# EasyEDA Pro project Type_C硬盘盒_2025-09-27_14-32-02.eprj, board PCB_第一版
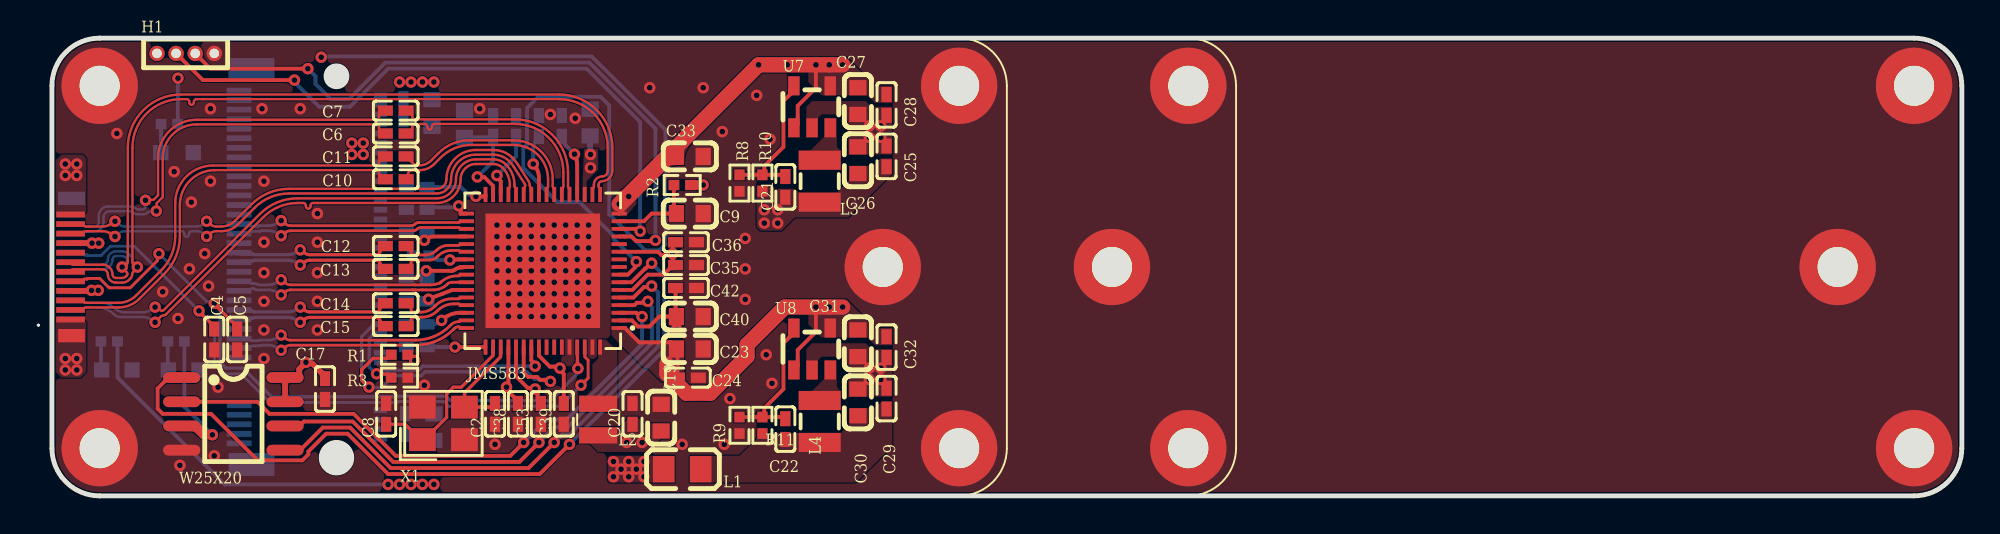
[diagram p3: board, top side]
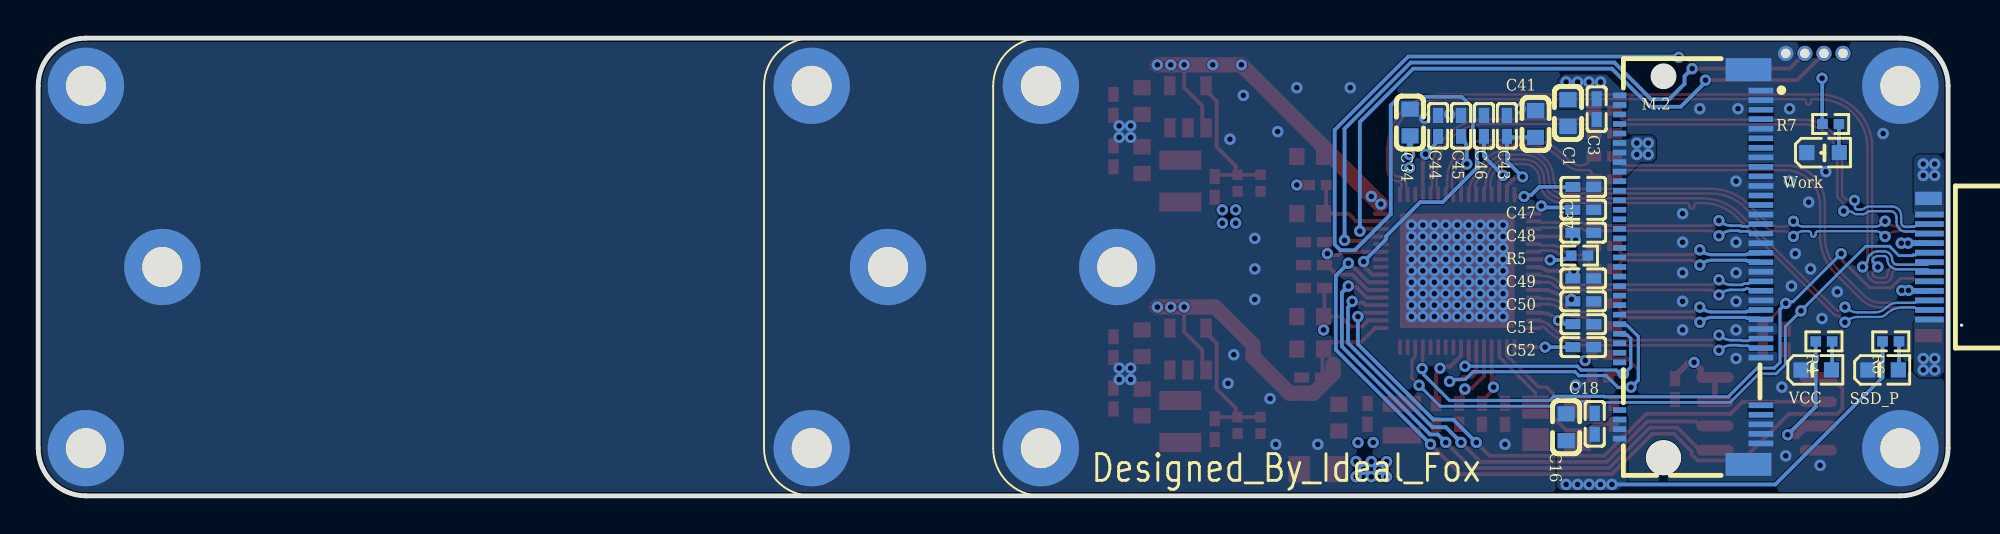
[diagram p4: board, bottom side, seen from below]

Outline 100.72 x 24 mm; copper layers: Top Layer, GND, VCC, Bottom Layer. Coordinates in mm from the lower left corner of the outline.
Outline path: 0.72,21.5 arc(1.45,23.27) 3.22,24 98.22,24 arc(99.99,23.27) 100.72,21.5 100.72,2.5 arc(99.99,0.73) 98.22,0 3.22,0 arc(1.45,0.73) 0.72,2.5 0.72,21.5
Stack: Top Layer 0.035mm / Dielectric 1 0.0711mm PP-006 er 4.1 / GND 0.0175mm / Dielectric1 0.32mm FR-4 er 4.8 / VCC 0.0175mm / Dielectric 2 0.0711mm PP-006 er 4.1 / Bottom Layer 0.035mm

## Design rules (mm)
net N_P1_TX: 85oum
net N_P0_TX: 85oum
net P1_TX: 85oum
net P1_RX: 85oum
net P0_TX: 85oum
net P0_RX: 85oum
net CLK: 85oum
net U_TX2: 90oum
net U_TX1: 90oum
net TX2: 90oum
net TX1: 90oum
net RX2: 90oum
net RX1: 90oum
net D: 90oum
net C1: 1_P1
net C2: 1_P1
net C3: 1_P1
net C4: 1_P1
net C5: 1_P1
net C6: 1_P1
net C7: 1_P1
net C8: 1_P1
net C9: 1_P1
net C10: 1_P1
net C11: 1_P1
net C12: 1_P1
net C13: 1_P1
net C14: 1_P1
net C15: 1_P1
net C16: 1_P1
net C17: 1_P1
net C18: 1_P1
net C19: 1_P1
net C20: 1_P1
net C21: 1_P1
net C22: 1_P1
net C23: 1_P1
net C24: 1_P1
net C25: 1_P1
net C26: 1_P1
net C27: 1_P1
net C28: 1_P1
net C29: 1_P1
net C30: 1_P1
net C31: 1_P1
net C32: 1_P1
net C33: 1_P1
net C34: 1_P1
net C35: 1_P1
net C36: 1_P1
net C37: 1_P1
net C38: 1_P1
net C39: 1_P1
net C40: 1_P1
net C41: 1_P1
net C42: 1_P1
net C43: 1_P1
net C44: 1_P1
net C45: 1_P1
net C46: 1_P1
net C47: 1_P1
net C48: 1_P1
net C49: 1_P1
net C50: 1_P1
net C51: 1_P1
net C52: 1_P1
net C53: 1_P1
net H1: 1_P1
net L1: 1_P1
net L2: 1_P1
net L3: 1_P1
net L4: 1_P1
net R1: 1_P1
net R2: 1_P1
net R3: 1_P1
net R4: 1_P1
net R5: 1_P1
net R6: 1_P1
net R7: 1_P1
net R8: 1_P1
net R9: 1_P1
net R10: 1_P1
net R11: 1_P1
net U7: 1_P1
net U8: 1_P1
net USB1: 1_P1
net X1: 1_P1
net JMS583: 1_P1
net W25X20: 1_P1
net M.2: 1_P1
net Work: 1_P1
net SSD_P: 1_P1
net VCC: 1_P1
net Designator15: Inside Board Components
net Designator12: Inside Board Components
net Designator14: Inside Board Components
net Designator13: Inside Board Components
net Designator11: Inside Board Components
net Designator10: Inside Board Components
net Designator9: Inside Board Components
net Designator8: Inside Board Components
net Designator7: Inside Board Components
net Designator4: Inside Board Components
net Designator6: Inside Board Components
net U_TX2_P: U_TX2
net U_TX2_N: U_TX2
net N_P1_TX_P: N_P1_TX
net N_P1_TX_N: N_P1_TX
net N_P0_TX_N: N_P0_TX
net N_P0_TX_P: N_P0_TX
net U_TX1_P: U_TX1
net U_TX1_N: U_TX1
net P1_TX_P: P1_TX
net P1_TX_N: P1_TX
net P1_RX_P: P1_RX
net P1_RX_N: P1_RX
net P0_TX_P: P0_TX
net P0_TX_N: P0_TX
net P0_RX_P: P0_RX
net P0_RX_N: P0_RX
net CLK_P: CLK
net CLK_N: CLK
net TX2_P: TX2
net TX2_N: TX2
net TX1_P: TX1
net TX1_N: TX1
net RX2_P: RX2
net RX2_N: RX2
net RX1_P: RX1
net RX1_N: RX1
net D_P: D
net D_N: D
template: 用户自定义配置
spacing safeClearance (default): track to track 0.119, other pairs 0 to 0.201
track width copperThickness1oz_2 (default): min 0.127, default 0.254, max 2.54
differential pair DiffPairsRouting_90oum (default): width min 0.099, default 0.124, max 0.381; gap min 0.099, default 0.119
differential pair DiffPairsRouting_85oum: width min 0.099, default 0.145, max 0.381; gap min 0.099, default 0.119
via viaSize (default): diameter min 0.5, default 0.61, max 10; hole min 0.3, default 0.305, max 6.299

## Placement (name value [footprint] x y rotation side)
C1  -  [C0603]  20.62 20.07 270 bottom
C2  -  [C0402]  23.92 4.3 90 top
C3  -  [C0402]  19.12 20.27 90 bottom
C4  -  [C0402]  9.22 8.2 270 top
C5  -  [C0402]  10.42 8.2 270 top
C6  -  [C0402]  18.72 19 0 top
C7  -  [C0402]  18.72 20.2 0 top
C8  -  [C0402]  18.22 4.3 270 top
C9  -  [C0603]  34.12 14.8 180 top
C10  -  [C0402]  18.72 16.6 0 top
C11  -  [C0402]  18.72 17.8 0 top
C12  -  [C0402]  18.72 13.1 180 top
C13  -  [C0402]  18.72 11.9 180 top
C14  -  [C0402]  18.72 10.1 180 top
C15  -  [C0402]  18.72 8.9 180 top
C16  -  [C0603]  20.72 3.6 90 bottom
C17  -  [C0402]  15.02 5.6 90 top
C18  -  [C0402]  19.22 3.77 270 bottom
C19  -  [C0603]  32.62 4.1 270 top
C20  -  [C0402]  31.12 4.3 270 top
C21  -  [C0402]  39.12 16.2 90 top
C22  -  [C0402]  39.12 3.5 90 top
C23  -  [C0603]  34.12 7.7 180 top
C24  -  [C0402]  34.02 6.2 180 top
C25  -  [C0402]  44.42 17.8 270 top
C26  -  [C0603]  42.92 17.6 270 top
C27  -  [C0603]  42.92 20.7 90 top
C28  -  [C0402]  44.42 20.5 90 top
C29  -  [C0402]  44.42 5.1 270 top
C30  -  [C0603]  42.92 4.9 270 top
C31  -  [C0603]  42.92 8 90 top
C32  -  [C0402]  44.42 7.8 90 top
C33  -  [C0603]  34.12 17.8 180 top
C34  -  [C0603]  28.89 19.58 270 bottom
C35  -  [C0402]  33.92 12.1 180 top
C36  -  [C0402]  33.92 13.3 180 top
C37  -  [C0402]  19.82 16.2 0 bottom
C38  -  [C0402]  25.12 4.3 90 top
C39  -  [C0402]  27.52 4.3 90 top
C40  -  [C0603]  34.12 9.4 180 top
C41  -  [C0603]  22.32 19.5 270 bottom
C42  -  [C0402]  33.92 10.9 180 top
C43  -  [C0402]  23.82 19.4 270 bottom
C44  -  [C0402]  27.42 19.4 270 bottom
C45  -  [C0402]  26.22 19.4 270 bottom
C46  -  [C0402]  25.02 19.4 270 bottom
C47  -  [C0402]  19.82 15 0 bottom
C48  -  [C0402]  19.82 13.8 0 bottom
C49  -  [C0402]  19.82 11.4 0 bottom
C50  -  [C0402]  19.82 10.2 0 bottom
C51  -  [C0402]  19.82 9 0 bottom
C52  -  [C0402]  19.82 7.8 0 bottom
C53  -  [C0402]  26.32 4.3 90 top
Designator4  -  [M2_HOLE]  48.22 2.5 0 top
Designator6  -  [M2_HOLE]  44.22 12 0 top
Designator7  -  [M2_HOLE]  48.22 21.5 0 top
Designator8  -  [M2_HOLE]  60.22 21.5 0 top
Designator9  -  [M2_HOLE]  60.22 2.5 0 top
Designator10  -  [M2_HOLE]  98.22 21.5 0 top
Designator11  -  [M2_HOLE]  94.22 12 0 top
Designator12  -  [M2_HOLE]  56.22 12 0 top
Designator13  -  [M2_HOLE]  3.22 21.5 0 top
Designator14  -  [M2_HOLE]  3.22 2.5 0 top
Designator15  -  [M2_HOLE]  98.22 2.5 0 top
H1  -  [HDR-TH_ZX-PZ1.0-1-4PZZ]  7.72 23.2 0 top
JMS583  -  [QFN-64_L8.0-W8.0-P0.40-TL-EP6.0]  26.42 11.8 180 top
L1  -  [L0805]  33.72 1.4 180 top
L2  -  [IND-SMD_L2.5-W2.0-VLS252012CX-150M]  29.32 4 90 top
L3  -  [IND-SMD_L2.5-W2.0_MHCHL2520]  40.92 16.5 90 top
L4  -  [IND-SMD_L2.5-W2.0_MHCHL2520]  40.92 3.9 90 top
M.2  -  [CONN-SMD_91302-225-067RCM]  14.22 12 270 bottom
R1  -  [R0402]  18.92 7.4 0 top
R2  -  [R0402]  33.72 16.3 180 top
R3  -  [R0402]  18.92 6.2 0 top
R4  -  [R0402]  7.22 8.1 180 bottom
R5  -  [R0402]  20.02 12.6 180 bottom
R6  -  [R0402]  3.72 8.1 180 bottom
R7  -  [R0402]  6.87 19.5 180 bottom
R8  -  [R0402]  36.72 16.4 90 top
R9  -  [R0402]  36.72 3.7 90 top
R10  -  [R0402]  37.92 16.4 270 top
R11  -  [R0402]  37.92 3.7 270 top
SSD_P  -  [LED0603-RD_GREEN]  4.12 6.6 180 bottom
U7  -  [SOT-23-5_L2.9-W1.6-P0.95-LS2.8-BL]  40.52 20.4 0 top
U8  -  [SOT-23-5_L2.9-W1.6-P0.95-LS2.8-BL]  40.52 7.7 0 top
USB1  -  [USB-TYPE-C-SMD_U261-241N-4BS60]  1.72 12 90 bottom
VCC  -  [LED0603-RD_GREEN]  7.62 6.6 180 bottom
W25X20  -  [SOIC-8_L5.0-W4.0-P1.27-LS6.0-BL]  10.22 4.3 270 top
Work  -  [LED0603-R-RD]  7.27 18 180 bottom
X1  -  [CRYSTAL-SMD_4P-L3.2-W2.5-BL]  21.22 3.8 0 top

## Footprints (pads in the part's own frame, mm; a bottom-side part is the same pattern mirrored in y, then rotated)
C0402
  rect 0.79x0.54 smd: 1(-0.545,0) 2(0.545,0)
C0603
  rect 0.8x0.9 smd: 1(-0.7,0) 2(0.7,0)
CONN-SMD_91302-225-067RCM
  rect 0.3x1.3 smd: 1(-9.25,3.7) 3(-8.75,3.7) 5(-8.25,3.7) 7(-7.75,3.7) 9(-7.25,3.7) 11(-6.75,3.7) 13(-6.25,3.7) 15(-5.75,3.7) 17(-5.25,3.7) 19(-4.75,3.7) 21(-4.25,3.7) 23(-3.75,3.7) 25(-3.25,3.7) 27(-2.75,3.7) 29(-2.25,3.7) 31(-1.75,3.7) 33(-1.25,3.7) 35(-0.75,3.7) 37(-0.25,3.7) 39(0.25,3.7) 41(0.75,3.7) 43(1.25,3.7) 45(1.75,3.7) 47(2.25,3.7) 49(2.75,3.7) 51(3.25,3.7) 53(3.75,3.7) 55(4.25,3.7) 57(4.75,3.7) 67(7.25,3.7) 69(7.75,3.7) 71(8.25,3.7) 73(8.75,3.7) 75(9.25,3.7)
  rect 0.3x0.7 smd: 2(-9,-3.7) 4(-8.5,-3.7) 6(-8,-3.7) 8(-7.5,-3.7) 10(-7,-3.7) 12(-6.5,-3.7) 14(-6,-3.7) 16(-5.5,-3.7) 18(-5,-3.7) 20(-4.5,-3.7) 22(-4,-3.7) 24(-3.5,-3.7) 26(-3,-3.7) 28(-2.5,-3.7) 30(-2,-3.7) 32(-1.5,-3.7) 34(-1,-3.7) 36(-0.5,-3.7) 38(0,-3.7) 40(0.5,-3.7) 42(1,-3.7) 44(1.5,-3.7) 46(2,-3.7) 48(2.5,-3.7) 50(3,-3.7) 52(3.5,-3.7) 54(4,-3.7) 56(4.5,-3.7) 58(5,-3.7) 68(7.5,-3.7) 70(8,-3.7) 72(8.5,-3.7) 74(9,-3.7)
  rect 1.2x2.4 smd: 76(-10.35,3.05) 77(10.35,3.05)
CRYSTAL-SMD_4P-L3.2-W2.5-BL
  rect 1.4x1.2 smd: 1(-1.1,-0.85) 2(1.1,-0.85) 3(1.1,0.85) 4(-1.1,0.85)
HDR-TH_ZX-PZ1.0-1-4PZZ
  round 0.8 hole 0.5: 1(-1.5,0) 2(-0.5,0) 3(0.5,0) 4(1.5,0)
IND-SMD_L2.5-W2.0-VLS252012CX-150M
  rect 0.85x2 smd: 1(-0.83,0) 2(0.83,0)
IND-SMD_L2.5-W2.0_MHCHL2520
  rect 1x2.2 smd: 1(-1.1,0) 2(1.1,0)
L0805
  rect 1.133x1.377 smd: 1(-0.966,0) 2(0.966,0)
LED0603-R-RD
  rect 0.8x0.8 smd: 1(0.851,0) 2(-0.851,0)
LED0603-RD_GREEN
  rect 0.8x0.8 smd: 1(-0.799,-0.004) 2(0.799,0.004)
M2_HOLE
  round 4 hole 2.1: 16(0,0)
QFN-64_L8.0-W8.0-P0.40-TL-EP6.0
  rect 0.8x0.2 smd: 1(-4,3) 2(-4,2.6) 3(-4,2.2) 4(-4,1.8) 5(-4,1.4) 6(-4,1) 7(-4,0.6) 8(-4,0.2) 9(-4,-0.2) 10(-4,-0.6) 11(-4,-1) 12(-4,-1.4) 13(-4,-1.8) 14(-4,-2.2) 15(-4,-2.6) 16(-4,-3) 33(4,-3) 34(4,-2.6) 35(4,-2.2) 36(4,-1.8) 37(4,-1.4) 38(4,-1) 39(4,-0.6) 40(4,-0.2) 41(4,0.2) 42(4,0.6) 43(4,1) 44(4,1.4) 45(4,1.8) 46(4,2.2) 47(4,2.6) 48(4,3)
  rect 0.2x0.8 smd: 17(-3,-4) 18(-2.6,-4) 19(-2.2,-4) 20(-1.8,-4) 21(-1.4,-4) 22(-1,-4) 23(-0.6,-4) 24(-0.2,-4) 25(0.2,-4) 26(0.6,-4) 27(1,-4) 28(1.4,-4) 29(1.8,-4) 30(2.2,-4) 31(2.6,-4) 32(3,-4) 49(3,4) 50(2.6,4) 51(2.2,4) 52(1.8,4) 53(1.4,4) 54(1,4) 55(0.6,4) 56(0.2,4) 57(-0.2,4) 58(-0.6,4) 59(-1,4) 60(-1.4,4) 61(-1.8,4) 62(-2.2,4) 63(-2.6,4) 64(-3,4)
  rect 6x6 smd: 65(0,0)
R0402
  rect 0.566x0.54 smd: 1(-0.433,0) 2(0.433,0)
SOIC-8_L5.0-W4.0-P1.27-LS6.0-BL
  oval 0.569x1.95 smd: 1(-1.905,-2.705) 2(-0.635,-2.705) 3(0.635,-2.705) 4(1.905,-2.705) 5(1.905,2.705) 6(0.635,2.705) 7(-0.635,2.705) 8(-1.905,2.705)
SOT-23-5_L2.9-W1.6-P0.95-LS2.8-BL
  rect 0.6x1 smd: 1(-0.95,-1.1) 2(0,-1.1) 3(0.95,-1.1) 4(0.95,1.1) 5(-0.95,1.1)
USB-TYPE-C-SMD_U261-241N-4BS60
  rect 0.7x1.4 smd far side: 1(-3.6,0.025)
  rect 0.7x1.4 smd: 2(3.6,0.025)
  rect 0.3x1.5 smd: A1(2.75,-0.025) A2(2.25,-0.025) A3(1.75,-0.025) A4(1.25,-0.025) A5(0.75,-0.025) A6(0.25,-0.025) A7(-0.25,-0.025) A8(-0.75,-0.025) A9(-1.25,-0.025) A10(-1.75,-0.025) A11(-2.25,-0.025) A12(-2.75,-0.025)
  rect 0.3x1.5 smd far side: B1(-2.75,-0.025) B2(-2.25,-0.025) B3(-1.75,-0.025) B4(-1.25,-0.025) B5(-0.75,-0.025) B6(-0.25,-0.025) B7(0.25,-0.025) B8(0.75,-0.025) B9(1.25,-0.025) B10(1.75,-0.025) B11(2.25,-0.025) B12(2.75,-0.025)

## Nets
3V3: C22.1 C29.2 C30.2 L1.1 L4.1 R11.2
AVDDL: C19.2 C20.2 C21.1 C25.2 C26.2 C40.2 C41.2 C42.2 C43.2 C44.2 C45.2 C46.2 C47.2 C48.2 C49.2 C50.2 C51.2 C52.2 C53.2 JMS583.2 JMS583.20 JMS583.25 JMS583.30 JMS583.31 JMS583.33 JMS583.36 JMS583.40 JMS583.43 JMS583.46 JMS583.49 JMS583.53 L2.1 L3.1 R10.2
GND: C1.2 C2.1 C3.1 C4.2 C5.2 C8.1 C9.1 C16.2 C17.1 C18.1 C19.1 C20.1 C23.1 C24.1 C25.1 C26.1 C27.1 C28.1 C29.1 C30.1 C31.1 C32.1 C33.1 C34.1 C35.1 C36.1 C37.1 C38.1 C39.1 C40.1 C41.1 C42.1 C43.1 C44.1 C45.1 C46.1 C47.1 C48.1 C49.1 C50.1 C51.1 C52.1 C53.1 Designator4.16 Designator6.16 Designator7.16 Designator8.16 Designator9.16 Designator10.16 Designator11.16 Designator12.16 Designator13.16 Designator14.16 Designator15.16 H1.4 JMS583.60 JMS583.63 JMS583.65 M.2.1 M.2.3 M.2.9 M.2.15 M.2.21 M.2.27 M.2.33 M.2.39 M.2.45 M.2.51 M.2.57 M.2.71 M.2.73 M.2.75 M.2.76 M.2.77 R3.2 R5.2 R8.1 R9.1 SSD_P.1 U7.2 U8.2 USB1.1 USB1.2 USB1.A1 USB1.A12 USB1.B1 USB1.B12 VCC.1 W25X20.4 Work.2 X1.2 X1.4
VCC: C17.2 C34.2 C35.2 C36.2 C37.2 C38.2 C39.2 H1.1 JMS583.6 JMS583.11 JMS583.19 JMS583.32 JMS583.52 JMS583.56 R1.2 R2.1 R4.1 W25X20.3 W25X20.7 W25X20.8
VDDREG: C23.2 C24.2 C27.2 C28.2 C31.2 C32.2 C33.2 JMS583.1 JMS583.16 U7.1 U7.4 U8.1 U8.4 USB1.A4 USB1.A9 USB1.B4 USB1.B9
CC1: C4.1 JMS583.62 USB1.A5
CC2: C5.1 JMS583.61 USB1.B5
CLK_N: JMS583.47 M.2.53
CLK_P: JMS583.48 M.2.55
D_N: JMS583.17 USB1.A7 USB1.B7
D_P: JMS583.18 USB1.A6 USB1.B6
GPIO0: JMS583.3 W25X20.2
GPIO1: JMS583.4 W25X20.6
GPIO2: JMS583.5 W25X20.5
GPIO3: JMS583.7 W25X20.1
GPIO4: JMS583.8 R7.1
GPIO8: H1.3 JMS583.13
GPIO9: H1.2 JMS583.14
LXO: JMS583.64 L2.2
M.2_3V3: C1.1 C3.2 C16.1 C18.2 L1.2 M.2.2 M.2.4 M.2.12 M.2.14 M.2.16 M.2.18 M.2.70 M.2.72 M.2.74 R6.1
N_P0_TX_N: C14.2 M.2.47
N_P0_TX_P: C15.2 M.2.49
N_P1_TX_N: C12.2 M.2.35
N_P1_TX_P: C13.2 M.2.37
NETC21_2: C21.2 R8.2 R10.1 U7.5
NETC22_2: C22.2 R9.2 R11.1 U8.5
NETL3_2: L3.2 U7.3
NETL4_2: L4.2 U8.3
NETR4_2: R4.2 VCC.2
NETR5_1: JMS583.39 R5.1
NETR6_2: R6.2 SSD_P.2
NETR7_2: R7.2 Work.1
P0_RX_N: JMS583.41 M.2.41
P0_RX_P: JMS583.42 M.2.43
P0_TX_N: C14.1 JMS583.44
P0_TX_P: C15.1 JMS583.45
P1_RX_N: JMS583.34 M.2.29
P1_RX_P: JMS583.35 M.2.31
P1_TX_N: C12.1 JMS583.37
P1_TX_P: C13.1 JMS583.38
PCIE_CLK: JMS583.55 M.2.52 R3.1
PCIE_RST: JMS583.54 M.2.50 R1.1
RST: C9.2 JMS583.15 R2.2
RX1_N: JMS583.27 USB1.B10
RX1_P: JMS583.26 USB1.B11
RX2_N: JMS583.28 USB1.A10
RX2_P: JMS583.29 USB1.A11
SBU1: USB1.A8
SBU2: USB1.B8
TX1_N: C6.2 JMS583.22
TX1_P: C7.2 JMS583.21
TX2_N: C11.2 JMS583.23
TX2_P: C10.2 JMS583.24
U_TX1_N: C6.1 USB1.A3
U_TX1_P: C7.1 USB1.A2
U_TX2_N: C11.1 USB1.B3
U_TX2_P: C10.1 USB1.B2
XIN: C8.2 JMS583.50 X1.1
XOUT: C2.2 JMS583.51 X1.3

Pads without a net: JMS583 9 10 12 57 58 59; M.2 5 6 7 8 10 11 13 17 19 20 22 23 24 25 26 28 30 32 34 36 38 40 42 44 46 48 54 56 58 67 68 69

## Via types
v1: diameter 0.6, hole 0.3, Top Layer to Bottom Layer, 249 vias

## Routing (per net, layer and track width the routed paths; a pad name or vN(x,y) marks a point on that pad's centre or on a via; arc(x,y) is an arc through that point)
AVDDL: length 89.4
  Top Layer w0.2: JMS583.46 22.08,9.6 arc(21.56,9.5) v1(21.12,9.2) ; v1(20.32,11.8) 21.62,11.8 arc(21.64,11.8) 21.66,11.8 arc(21.69,11.81) 21.72,11.81 arc(21.78,11.83) 21.84,11.87 arc(21.91,11.92) 21.99,11.95 JMS583.40 ; JMS583.20 28.22,17.42 arc(28.21,17.54) 28.18,17.65 v1(28.08,17.92) ; v1(21.82,7.8) JMS583.49 ; v1(22.02,15.2) 22.02,15.09 22.12,14.99 22.12,14.8 JMS583.33 ; v1(33.42,8.7) C40.2 32.52,9.4 32,8.88 31.4,8.88 31.08,9.2 JMS583.2 ; JMS583.25 26.22,16.68 arc(26.14,17.07) v1(25.92,17.4) ; v1(23,16.72) 23.35,16.72 23.82,16.25 JMS583.31 ; JMS583.30 24.22,16.5 24.02,16.7 v1(24.02,16.8) ; C53.2 26.15,5.02 26.15,5.36 26.02,5.49 v1(26.02,5.6) 25.96,5.66 25.63,5.66 25.02,6.27 JMS583.53 ; v1(20.44,10.31) 20.64,10.4 arc(20.65,10.41) 20.66,10.41 21.15,10.59 arc(21.16,10.59) 21.18,10.6 21.65,10.79 arc(21.69,10.8) 21.73,10.8 JMS583.43 ; JMS583.36 20.7,13.6 arc(20.44,13.55) v1(20.22,13.4) ; 33.37,9.44 C42.2
  Top Layer w0.5: v1(33.42,8.7) C40.2 33.37,9.44
  VCC w0.5: v1(33.42,8.7) 35.42,6.7 ; 25.98,4.12 26.02,4.16 v1(26.02,5.6)
  VCC w0.6: v1(28.08,17.92) 27.36,17.2 27.22,17.2
  VCC w1.8: 38.38,14.66 38.38,9.66 32.02,3.3 29.09,3.3 28.27,4.12 23.7,4.12 21.42,6.4 21.42,8.1 19.92,9.6 19.92,13.6 21.52,15.2 21.52,15.5 21.6,15.58 21.6,16.25 22.55,17.2 27.22,17.2
  Bottom Layer w0.172: 20.43,13.61 20.43,13.73 C48.2 20.22,13.66 v1(20.22,13.4)
  Bottom Layer w0.2: v1(22.02,15.2) 21.94,15.12 20.49,15.12 C47.2 ; C41.2 23.76,18.8 C43.2 23.82,17.55 v1(23,16.72) ; C51.2 20.64,9 arc(20.9,9.05) v1(21.12,9.2) ; v1(24.02,16.8) 25.02,17.8 C46.2 ; v1(20.32,11.8) 20.32,11.51 arc(20.33,11.45) C49.2 ; v1(25.92,17.4) 25.92,18.13 arc(26,18.52) C45.2 ; v1(28.08,17.92) 27.61,18.39 arc(27.47,18.6) C44.2 ; C52.2 v1(21.82,7.8)
  vias: v1(30.82,2.8) v1(31.62,2.8) v1(38.02,15) v1(38.02,14.3) v1(38.72,15) v1(38.72,14.3)
GND:
  vias: v1(1.42,17.4) v1(1.42,16.8) v1(1.42,7.2) v1(1.42,6.6) v1(2.02,17.4) v1(2.02,16.8) v1(2.02,7.2) v1(2.02,6.6) v1(4.12,19) v1(6.52,10.7) v1(7.12,17) v1(7.32,9.3) v1(7.42,1.6) v1(7.92,11.9) v1(8.02,15.4) v1(8.72,12.7) v1(8.92,11) v1(9.02,20.3) v1(9.02,16.5) v1(9.22,2.1) v1(9.42,5.7) v1(11.72,20.3) v1(11.82,16.5) v1(11.82,13.3) v1(11.82,11.7) v1(11.82,10.2) v1(11.82,8.7) v1(11.82,7.2) v1(13.72,20.3) v1(14.62,14.8) v1(14.62,13.3) v1(14.62,11.7) v1(14.62,10.2) v1(14.62,8.7) v1(20.22,5.8) v1(23.12,20.3) v1(23.92,2.7) v1(24.02,14.2) v1(24.02,13.6) v1(24.02,13) v1(24.02,12.4) v1(24.02,11.8) v1(24.02,11.2) v1(24.02,10.6) v1(24.02,10) v1(24.02,9.4) v1(24.62,14.2) v1(24.62,13.6) v1(24.62,13) v1(24.62,12.4) v1(24.62,11.8) v1(24.62,11.2) v1(24.62,10.6) v1(24.62,10) v1(24.62,9.4) v1(25.22,14.2) v1(25.22,13.6) v1(25.22,13) v1(25.22,12.4) v1(25.22,11.8) v1(25.22,11.2) v1(25.22,10.6) v1(25.22,10) v1(25.22,9.4) v1(25.82,14.2) v1(25.82,13.6) v1(25.82,13) v1(25.82,12.4) v1(25.82,11.8) v1(25.82,11.2) v1(25.82,10.6) v1(25.82,10) v1(25.82,9.4) v1(26.42,14.2) v1(26.42,13.6) v1(26.42,13) v1(26.42,12.4) v1(26.42,11.8) v1(26.42,11.2) v1(26.42,10.6) v1(26.42,10) v1(26.42,9.4) v1(26.82,20) v1(27.02,14.2) v1(27.02,13.6) v1(27.02,13) v1(27.02,12.4) v1(27.02,11.8) v1(27.02,11.2) v1(27.02,10.6) v1(27.02,10) v1(27.02,9.4) v1(27.62,14.2) v1(27.62,13.6) v1(27.62,13) v1(27.62,12.4) v1(27.62,11.8) v1(27.62,11.2) v1(27.62,10.6) v1(27.62,10) v1(27.62,9.4) v1(28.12,19.8) v1(28.22,14.2) v1(28.22,13.6) v1(28.22,13) v1(28.22,12.4) v1(28.22,11.8) v1(28.22,11.2) v1(28.22,10.6) v1(28.22,10) v1(28.22,9.4) v1(28.82,14.2) v1(28.82,13.6) v1(28.82,13) v1(28.82,12.4) v1(28.82,11.8) v1(28.82,11.2) v1(28.82,10.6) v1(28.82,10) v1(28.82,9.4) v1(32.02,21.4) v1(33.72,2.7) v1(34.82,21.4) v1(35.82,19.1) v1(35.92,2.7) v1(36.22,5.1) v1(37.02,13.5) v1(37.02,11.9) v1(37.02,10.3) v1(37.62,21) v1(38.12,7.4) v1(38.32,18.7) v1(38.42,5.9) v1(43.52,19.4) v1(43.52,18.8) v1(43.52,6.7) v1(43.52,6.1) v1(44.12,19.4) v1(44.12,18.8) v1(44.12,6.7) v1(44.12,6.1)
VCC: length 128.4
  Top Layer w0.2: C36.2 33.22,13.14 v1(33.22,12.7) ; v1(33.22,12.7) 33.22,12.13 33.25,12.1 32.75,11.6 31.91,11.6 31.11,10.8 JMS583.6 ; v1(33.22,12.7) 33.14,12.62 32.63,12.62 32.46,12.8 JMS583.11 ; JMS583.52 24.62,5.91 24.52,5.81 v1(24.52,5.7) 24.6,5.62 24.6,5.49 25.12,4.97 C38.2 ; JMS583.32 23.42,15.7 v1(22.92,15.7) ; C39.2 27.52,6.39 27.32,6.59 v1(27.32,6.7) 27.24,6.78 26.79,6.78 26.22,7.35 JMS583.56
  Top Layer w0.3: C17.2 15.02,6.27 14.35,6.94 14.08,6.94 v1(14.02,7) 13.67,6.65 13.67,6.33 13.54,6.2 W25X20.8 W25X20.7
  Top Layer w0.5: v1(9.12,3.2) 9.1,3.22 8.67,3.22 8.22,3.67 W25X20.3 ; R2.1 v1(34.82,16.3)
  GND w1: v1(14.02,7) 16.24,4.78 17.7,4.78 19.72,6.8 v1(19.72,7.1)
  VCC w0.6: 28.94,17.55 28.94,17.22 v1(28.92,17.2) ; v1(24.52,5.7) 24.52,6.32 26.2,8 27.32,8 ; 27.32,8 27.42,8.1 ; 27.32,8 v1(27.32,6.7) ; v1(22.92,15.7) 29.52,15.7 29.52,17.3 v1(28.92,17.9)
  VCC w0.8: H1.1 6.22,19.77 1.62,15.17 1.62,10.29 8.71,3.2 v1(9.12,3.2) ; v1(34.82,16.3) 34.82,14.3 v1(33.22,12.7)
  VCC w1: 29.5,17.32 29.5,14.82 29.74,14.58 29.74,9.02 28.82,8.1 27.42,8.1 ; v1(9.12,3.2) 10.22,3.2 v1(14.02,7) ; 29.27,17.55 33.57,17.55 v1(34.82,16.3) ; v1(19.72,7.1) 18.4,8.42 18.4,15.2 22.04,18.84 28.46,18.84 29,18.3 29,17.9
  Bottom Layer w0.2: v1(22.92,15.7) 22.84,15.77 22.54,15.77 22.12,16.2 C37.2 ; v1(9.12,3.2) 7.65,4.67 R4.1
  Bottom Layer w0.3: C34.2 28.89,17.92 arc(28.9,17.91) v1(28.92,17.9)
VDDREG: length 109.8
  Top Layer w0.2: U7.1 39.77,19.5 39.77,20.45 40.72,21.4 v1(40.72,22.6) ; C33.2 33.42,17.75 33.12,17.45 33.07,17.45 JMS583.16 ; C24.2 33.47,7.64 C23.2 33.42,7.75 33.12,8.05 31.47,8.05 30.72,8.8 JMS583.1 ; U8.1 39.77,6.8 39.77,7.65 40.72,8.6 v1(40.72,9.9)
  Top Layer w0.3: v1(3.17,13.25) v1(2.82,13.25) USB1.A4 ; v1(3.14,10.78) 3.12,10.75 USB1.A9
  Top Layer w0.8: v1(30.42,15.3) v1(37.72,22.6) v1(40.72,22.6) v1(41.42,22.6) v1(42.12,22.6) ; 32.92,6.9 32.92,6.4 33.94,5.38 35.19,5.38 37.11,7.31 37.11,7.92 39.09,9.9 v1(40.72,9.9) v1(41.42,9.9) v1(42.12,9.9)
  VCC w1.3: 2.79,13.25 2.79,14.69 6.64,18.54 14.13,18.54 18.49,22.9 30.15,22.9 30.45,22.6 v1(40.72,22.6) v1(41.42,22.6) v1(42.12,22.6) ; v1(2.82,13.25) 3.07,13 3.07,11.05 v1(2.79,10.78)
  VCC w2: v1(41.42,9.9) 41.07,10.25 41.07,13.7 41.42,14.05 v1(41.42,22.6)
  Bottom Layer w0.3: v1(3.14,10.78) 3.12,10.75 USB1.A9 ; v1(3.17,13.25) v1(2.82,13.25) USB1.A4
  vias: v1(30.92,15.7) v1(39.22,22.6)
CC1: length 35.6
  Top Layer w0.15: v1(28.42,5.8) 28.79,6.17 28.79,7.12 28.62,7.29 28.62,7.79 JMS583.62
  Top Layer w0.17: v1(8.42,9.7) 8.42,9.67 9.22,8.87 C4.1
  Bottom Layer w0.15: v1(28.42,5.8) 27.32,4.7 21.49,4.7 21.25,4.94 18.86,4.94 18.82,4.9 12.12,4.9 10.62,6.4 9.72,6.4 9.24,6.88 9.24,8.88 v1(8.42,9.7) 5.03,13.09 3.78,13.09 3.3,12.6 2.58,12.6 2.54,12.64 2.41,12.64 2.29,12.75 USB1.A5
CC2: length 36.4
  Top Layer w0.15: USB1.B5 2.29,11.25 2.41,11.36 2.54,11.36 2.58,11.4 3.22,11.4 3.71,10.91 4.82,10.91 6.24,12.33 6.24,12.62 v1(6.32,12.7)
  Top Layer w0.17: v1(28.26,6.68) 28.23,6.7 28.23,7.78 JMS583.61 ; C5.1 10.42,8.87 9.22,10.07 v1(9.22,10.1)
  Bottom Layer w0.15: v1(6.32,12.7) 8.84,10.18
  Bottom Layer w0.17: v1(28.26,6.68) 28.18,6.59 28.18,6.36 26.82,5 21.58,5 21.36,5.22 18.74,5.22 18.71,5.19 12.22,5.19 10.72,6.7 9.82,6.7 9.52,7 9.52,9.79 9.22,10.09 v1(9.22,10.1) 9.14,10.18 8.84,10.18
CLK_N: length 12.4
  Top Layer w0.145: JMS583.47 22.17,9.2 arc(22.12,9.19) 22.08,9.17 arc(22.05,9.14) 22,9.13 arc(21.79,9.09) 21.62,8.97 21.55,8.91 arc(20.73,8.36) 19.76,8.17 13.22,8.17 arc(13.05,8.2) 12.9,8.3 12.8,8.4 arc(12.76,8.42) v1(12.72,8.43)
  Bottom Layer w0.145: M.2.53 10.94,8.25 arc(11.01,8.23) 11.08,8.19 arc(11.14,8.15) 11.22,8.13 11.49,8.13 arc(11.51,8.14) 11.53,8.15 arc(11.55,8.16) 11.57,8.17 12.07,8.17 arc(12.38,8.23) 12.64,8.4 arc(12.68,8.42) v1(12.72,8.43)
CLK_P: length 12.4
  Top Layer w0.145: JMS583.48 22.17,8.8 arc(22.12,8.81) 22.08,8.83 arc(22.05,8.86) 22,8.87 arc(21.9,8.85) 21.8,8.78 21.74,8.72 arc(20.83,8.11) 19.76,7.9 13.22,7.9 arc(13.05,7.87) 12.9,7.77 12.8,7.66 arc(12.76,7.64) v1(12.72,7.63)
  Bottom Layer w0.145: M.2.55 10.94,7.75 arc(11.01,7.77) 11.08,7.81 arc(11.14,7.85) 11.22,7.87 11.6,7.87 arc(11.62,7.87) 11.64,7.88 arc(11.66,7.9) 11.68,7.9 12.07,7.9 arc(12.38,7.84) 12.64,7.66 arc(12.68,7.64) v1(12.72,7.63)
D_N: length 46
  Top Layer w0.125: JMS583.17 29.42,16.05 arc(29.41,16.1) 29.38,16.14 arc(29.35,16.18) 29.34,16.23 29.34,16.32 arc(29.39,16.45) 29.52,16.5 arc(29.9,16.66) 30.06,17.05 30.06,18.26 arc(29.25,20.23) 27.28,21.05 7.47,21.05 arc(5.51,20.23) 4.69,18.26 4.69,12.3 arc(4.6,12.09) v1(4.39,12) ; v1(4.39,12) arc(4.4,12.03) 4.42,12.05 ; v1(4.39,12) arc(4.4,11.97) 4.42,11.95 4.63,11.73 arc(4.66,11.69) 4.67,11.64 arc(4.66,11.59) 4.63,11.55 4.59,11.51 arc(4.5,11.45) 4.39,11.42 4.07,11.42 arc(3.95,11.48) 3.89,11.6 arc(3.74,11.97) 3.37,12.12 1.82,12.12 arc(1.73,12.16) USB1.B7
  Bottom Layer w0.125: USB1.A7 arc(1.73,11.84) 1.82,11.88 3.37,11.88 arc(3.74,12.03) 3.89,12.4 arc(3.95,12.52) 4.07,12.58 4.39,12.58 arc(4.5,12.55) 4.59,12.49 4.63,12.45 arc(4.66,12.41) 4.67,12.36 arc(4.66,12.31) 4.63,12.27 4.42,12.05 arc(4.4,12.03) v1(4.39,12)
D_P: length 46.3
  Top Layer w0.125: JMS583.18 29.02,16.05 arc(29.03,16.1) 29.06,16.14 arc(29.09,16.18) 29.1,16.23 29.1,16.32 arc(29.22,16.62) 29.52,16.75 arc(29.73,16.83) 29.82,17.05 29.82,18.26 arc(29.08,20.06) 27.28,20.8 8.28,20.8 arc(8.19,20.76) 8.15,20.67 8.15,20.62 arc(8.12,20.54) 8.03,20.5 arc(7.94,20.54) 7.91,20.62 7.91,20.67 arc(7.87,20.76) 7.78,20.8 7.48,20.8 arc(5.68,20.06) 4.94,18.26 4.94,12.26 arc(5.01,12.08) v1(5.19,12) ; v1(5.19,12) arc(5.19,11.97) 5.17,11.95 4.99,11.76 arc(4.94,11.68) 4.92,11.59 arc(4.9,11.49) 4.84,11.41 4.76,11.33 arc(4.59,11.22) 4.39,11.18 4.07,11.18 arc(3.77,11.3) 3.65,11.6 arc(3.57,11.8) 3.37,11.88 1.82,11.88 arc(1.73,11.84) USB1.B6 ; v1(5.19,12) arc(5.19,12.03) 5.17,12.05
  Bottom Layer w0.125: v1(5.19,12) arc(5.19,12.03) 5.17,12.05 4.99,12.24 arc(4.94,12.32) 4.92,12.41 arc(4.9,12.51) 4.84,12.59 4.76,12.67 arc(4.59,12.78) 4.39,12.82 4.07,12.82 arc(3.77,12.7) 3.65,12.4 arc(3.57,12.2) 3.37,12.12 1.82,12.12 arc(1.73,12.16) USB1.A6
GPIO0: length 30.4
  Top Layer w0.2: JMS583.3 31.31,9.6 31.51,9.4 v1(31.62,9.4) ; W25X20.2 11.48,4.94 12.11,4.3 16.52,4.3 18.72,2.1 24.72,2.1 v1(25.42,2.8)
  Bottom Layer w0.2: v1(25.42,2.8) 26.62,4 27.67,4 31.62,7.95 v1(31.62,9.4)
GPIO1: length 26.6
  Top Layer w0.2: W25X20.6 13.68,3.67 13.92,3.9 16.47,3.9 18.59,1.78 25.2,1.78 v1(26.22,2.8) ; v1(31.92,10.2) 31.84,10.12 31.34,10.12 31.22,10 JMS583.4
  Bottom Layer w0.2: v1(26.22,2.8) 27.02,3.6 27.72,3.6 32.14,8.02 32.14,9.88 31.92,10.1 v1(31.92,10.2)
GPIO2: length 28.8
  Top Layer w0.2: W25X20.5 13.71,2.39 14.9,3.58 16.33,3.58 18.45,1.46 25.68,1.46 v1(27.02,2.8) ; JMS583.5 31.17,10.4 31.72,10.95 32.07,10.95 v1(32.12,11)
  Bottom Layer w0.2: v1(27.02,2.8) 27.44,3.22 27.84,3.22 32.46,7.84 32.46,10.66 v1(32.12,11)
GPIO3: length 41.4
  Top Layer w0.2: W25X20.1 6.82,6.2 6.25,5.63 6.25,4.57 6.52,4.3 9.05,4.3 11.49,1.86 13.84,1.86 14.15,2.17 14.15,2.33 15.08,3.26 16.2,3.26 18.32,1.14 26.26,1.14 v1(27.82,2.7) ; JMS583.7 31.06,11.2 31.78,11.92 31.8,11.92 32.08,12.2 v1(32.12,12.2)
  Bottom Layer w0.2: v1(27.82,2.7) 32.78,7.66 32.78,11.54 v1(32.12,12.2)
GPIO4: length 62.9
  Top Layer w0.2: JMS583.8 30.87,11.6 31.24,11.97 31.24,12.2 v1(31.32,12.28)
  VCC w0.2: v1(7.32,21.9) 10.52,21.9 11.62,23 v1(14.82,23)
  Bottom Layer w0.2: v1(14.82,23) 14.86,23.04 28.98,23.04 32.84,19.19 32.84,13.18 32.53,12.88 31.78,12.88 29.9,14.76 29.9,20.47 29.45,20.92 26.18,20.92 25.6,20.34 25.6,18.42 25.4,18.22 25.4,17.18 27.18,15.4 28.35,15.4 30.14,13.62 30.14,13.46 v1(31.32,12.28) ; v1(7.32,21.9) 7.31,21.89 7.31,19.5 R7.1
GPIO8: length 35.4
  Top Layer w0.2: v1(14.12,22.4) 9.02,22.4 H1.3 ; v1(32.32,13.4) 32.28,13.36 31.3,13.36 31.06,13.6 JMS583.13
  Bottom Layer w0.2: v1(32.32,13.4) 32.32,19.25 28.85,22.72 18.19,22.72 16.27,20.8 15.32,20.8 14.52,21.6 14.52,22 v1(14.12,22.4)
GPIO9: length 34.4
  Top Layer w0.2: v1(31.52,13.88) 31.41,13.88 31.29,14 JMS583.14 ; v1(13.42,21.8) 8.62,21.8 H1.2
  Bottom Layer w0.2: v1(13.42,21.8) 13.42,21.69 14.71,20.4 16.32,20.4 18.32,22.4 28.72,22.4 31.52,19.6 v1(31.52,13.88)
M.2_3V3: length 18.4
  Bottom Layer w0.2: R6.1 4.15,6.21 9.76,0.6 v1(18.32,0.6)
  vias: v1(16.42,18.5) v1(16.42,17.9) v1(17.02,18.5) v1(17.02,17.9) v1(18.92,21.7) v1(18.92,0.6) v1(19.52,21.7) v1(19.52,0.6) v1(20.12,21.7) v1(20.12,0.6) v1(20.72,21.7) v1(20.72,0.6) v1(30.12,1.8) v1(30.12,1) v1(30.52,1.4) v1(30.92,1.8) v1(30.92,1) v1(31.32,1.4) v1(31.72,1.8) v1(31.72,1)
N_P0_TX_N: length 8.1
  Top Layer w0.172: v1(13.72,9.9) arc(13.78,9.89) 13.82,9.86 13.91,9.77 arc(14.05,9.68) 14.21,9.65 17.72,9.65 arc(17.79,9.66) 17.84,9.7 arc(17.88,9.75) 17.89,9.82 17.89,9.83 arc(17.91,9.91) 17.95,9.98 18.01,10.03 arc(18.08,10.08) C14.2
  Bottom Layer w0.172: v1(13.72,9.9) arc(13.66,9.89) 13.61,9.86 arc(13.38,9.7) 13.11,9.65 11.32,9.65 arc(11.29,9.65) 11.27,9.67 arc(11.25,9.68) 11.22,9.69 10.67,9.69 arc(10.59,9.7) M.2.47
N_P0_TX_P: length 8.1
  Top Layer w0.172: C15.2 arc(18.08,8.92) 18.01,8.97 17.95,9.02 arc(17.91,9.09) 17.89,9.17 17.89,9.18 arc(17.88,9.25) 17.84,9.3 arc(17.79,9.34) 17.72,9.35 14.21,9.35 arc(14.05,9.32) 13.91,9.23 13.82,9.14 arc(13.78,9.11) v1(13.72,9.1)
  Bottom Layer w0.172: M.2.49 arc(10.59,9.3) 10.67,9.31 11.22,9.31 arc(11.25,9.32) 11.27,9.33 arc(11.29,9.35) 11.32,9.35 13.11,9.35 arc(13.38,9.3) 13.61,9.14 arc(13.66,9.11) v1(13.72,9.1)
N_P1_TX_N: length 8.1
  Top Layer w0.172: C12.2 arc(18.08,13.08) 18.01,13.03 17.95,12.98 arc(17.91,12.91) 17.89,12.83 17.89,12.82 arc(17.88,12.75) 17.84,12.7 arc(17.79,12.66) 17.72,12.65 14.21,12.65 arc(14.05,12.68) 13.91,12.77 13.82,12.86 arc(13.78,12.89) v1(13.72,12.9)
  Bottom Layer w0.172: M.2.35 arc(10.59,12.7) 10.67,12.69 11.22,12.69 arc(11.25,12.68) 11.27,12.67 arc(11.29,12.65) 11.32,12.65 13.11,12.65 arc(13.38,12.7) 13.61,12.86 arc(13.66,12.89) v1(13.72,12.9)
N_P1_TX_P: length 8.1
  Top Layer w0.172: v1(13.72,12.1) arc(13.78,12.11) 13.82,12.14 13.91,12.23 arc(14.05,12.32) 14.21,12.35 17.72,12.35 arc(17.79,12.34) 17.84,12.3 arc(17.88,12.25) 17.89,12.18 17.89,12.17 arc(17.91,12.09) 17.95,12.02 18.01,11.97 arc(18.08,11.92) C13.2
  Bottom Layer w0.172: M.2.37 arc(10.59,12.3) 10.67,12.31 11.22,12.31 arc(11.25,12.32) 11.27,12.33 arc(11.29,12.35) 11.32,12.35 13.11,12.35 arc(13.38,12.3) 13.61,12.14 arc(13.66,12.11) v1(13.72,12.1)
NETC21_2: length 7.8
  Top Layer w0.2: 37.92,16.83 39.03,16.83 C21.2 ; 37.92,16.83 36.72,16.83 ; 37.92,16.83 38.02,16.93 38.02,17.3 39.02,18.3 39.02,20.7 39.37,21.05 39.37,21.3 U7.5
NETC22_2: length 7.8
  Top Layer w0.2: 37.92,4.13 38.02,4.23 38.02,4.6 39.02,5.6 39.02,8 39.37,8.35 39.37,8.6 U8.5 ; 37.92,4.13 36.72,4.13 ; 37.92,4.13 39.03,4.13 C22.2
NETR4_2: length 1.5
  Bottom Layer w0.2: VCC.2 6.79,6.64 R4.2
NETR5_1: length 2
  Top Layer w0.2: JMS583.39 22,12.4 arc(21.99,12.4) 21.99,12.4 v1(21.56,12.37)
  Bottom Layer w0.2: v1(21.56,12.37) 21.01,12.37 arc(20.71,12.43) R5.1
NETR6_2: length 1.5
  Bottom Layer w0.2: R6.2 3.29,6.64 SSD_P.2
NETR7_2: length 1.5
  Bottom Layer w0.2: Work.1 6.43,18.01 R7.2
P0_RX_N: length 12.2
  Top Layer w0.145: 20.52,11.06 20.12,11.06 arc(20.11,11.06) 20.11,11.06 19.74,11.06 19.69,11.06 13.22,11.06 arc(13.05,11.1) 12.9,11.2 12.8,11.3 arc(12.76,11.32) v1(12.72,11.33) ; JMS583.41 22.17,11.6 arc(22.12,11.59) 22.08,11.57 arc(22.05,11.54) 22,11.53 arc(21.52,11.47) 21.1,11.22 21.06,11.19 arc(21.04,11.17) 21.02,11.16 arc(20.78,11.09) 20.52,11.06
  Bottom Layer w0.145: M.2.41 10.94,11.25 arc(11.01,11.23) 11.08,11.19 arc(11.14,11.15) 11.22,11.13 11.38,11.13 arc(11.42,11.12) 11.46,11.1 arc(11.49,11.07) 11.54,11.06 12.07,11.06 arc(12.38,11.13) 12.64,11.3 arc(12.68,11.32) v1(12.72,11.33)
P0_RX_P: length 12.2
  Top Layer w0.145: JMS583.42 21.66,11.2 arc(21.53,11.17) 21.42,11.1 arc(21.09,10.88) 20.69,10.8 ; 19.59,10.8 13.22,10.8 arc(13.05,10.77) 12.9,10.67 12.8,10.56 arc(12.76,10.54) v1(12.72,10.53) ; 20.69,10.8 20.12,10.8 arc(20.11,10.8) 20.11,10.8 19.74,10.79 ; 19.74,10.79 arc(19.73,10.79) 19.73,10.79 19.6,10.8 arc(19.6,10.8) 19.59,10.8
  Bottom Layer w0.145: M.2.43 10.94,10.75 arc(11.01,10.77) 11.08,10.81 arc(11.14,10.85) 11.22,10.87 11.27,10.87 arc(11.31,10.86) 11.35,10.83 arc(11.39,10.81) 11.43,10.8 12.07,10.8 arc(12.38,10.74) 12.64,10.56 arc(12.68,10.54) v1(12.72,10.53)
P0_TX_N: length 3.6
  Top Layer w0.145: JMS583.44 22.17,10.4 arc(22.12,10.39) 22.08,10.37 arc(22.05,10.34) 22,10.33 21.65,10.33 arc(21.2,10.24) 20.81,9.98 20.76,9.93 arc(20.43,9.71) 20.03,9.63 19.67,9.63 arc(19.61,9.64) 19.56,9.67 arc(19.53,9.72) 19.52,9.78 arc(19.5,9.89) 19.43,9.99 arc(19.43,9.99) 19.43,9.99 19.37,10.06 arc(19.32,10.09) C14.1
P0_TX_P: length 3.6
  Top Layer w0.145: JMS583.45 22.17,10 arc(22.12,10.01) 22.08,10.03 arc(22.05,10.06) 22,10.07 21.76,10.07 arc(21.31,9.98) 20.92,9.72 20.91,9.71 arc(20.53,9.46) 20.09,9.37 19.67,9.37 arc(19.61,9.36) 19.56,9.33 arc(19.53,9.28) 19.52,9.22 arc(19.5,9.11) 19.43,9.01 arc(19.43,9.01) 19.43,9.01 19.37,8.94 arc(19.32,8.91) C15.1
P1_RX_N: length 12.2
  Top Layer w0.145: JMS583.34 22.17,14.4 arc(22.12,14.39) 22.08,14.37 arc(22.05,14.34) 22,14.33 19.93,14.33 arc(19.82,14.31) 19.72,14.25 arc(19.63,14.19) 19.52,14.17 13.22,14.17 arc(13.05,14.2) 12.9,14.3 12.8,14.4 arc(12.76,14.42) v1(12.72,14.43)
  Bottom Layer w0.145: M.2.29 10.94,14.25 arc(11.01,14.23) 11.08,14.19 arc(11.14,14.15) 11.22,14.13 11.49,14.13 arc(11.51,14.14) 11.53,14.15 arc(11.55,14.16) 11.57,14.17 12.07,14.17 arc(12.38,14.23) 12.64,14.4 arc(12.68,14.42) v1(12.72,14.43)
P1_RX_P: length 12.2
  Top Layer w0.145: JMS583.35 22.17,14 arc(22.12,14.01) 22.08,14.03 arc(22.05,14.06) 22,14.07 20.04,14.07 arc(19.93,14.05) 19.83,13.98 arc(19.74,13.92) 19.63,13.9 13.22,13.9 arc(13.05,13.87) 12.9,13.77 12.8,13.66 arc(12.76,13.64) v1(12.72,13.63)
  Bottom Layer w0.145: M.2.31 10.94,13.75 arc(11.01,13.77) 11.08,13.81 arc(11.14,13.85) 11.22,13.87 11.6,13.87 arc(11.62,13.87) 11.64,13.88 arc(11.66,13.9) 11.68,13.9 12.07,13.9 arc(12.38,13.84) 12.64,13.66 arc(12.68,13.64) v1(12.72,13.63)
P1_TX_N: length 3.6
  Top Layer w0.145: JMS583.37 22.17,13.2 arc(22.12,13.19) 22.08,13.17 arc(22.05,13.14) 22,13.13 21.47,13.13 arc(21.14,13.07) 20.86,12.88 arc(20.59,12.7) 20.26,12.63 19.67,12.63 arc(19.61,12.64) 19.56,12.67 arc(19.53,12.72) 19.52,12.78 19.52,12.81 arc(19.5,12.9) 19.46,12.97 19.37,13.06 arc(19.32,13.09) C12.1
P1_TX_P: length 3.6
  Top Layer w0.145: JMS583.38 22.17,12.8 arc(22.12,12.81) 22.08,12.83 arc(22.05,12.86) 22,12.87 21.64,12.87 arc(21.26,12.79) 20.93,12.58 20.87,12.52 arc(20.71,12.41) 20.51,12.37 19.67,12.37 arc(19.61,12.36) 19.56,12.33 arc(19.53,12.28) 19.52,12.22 19.52,12.19 arc(19.5,12.1) 19.46,12.03 19.37,11.94 arc(19.32,11.91) C13.1
PCIE_CLK: length 13.1
  Top Layer w0.172: R3.1 18.3,6.38 17.73,6.38 v1(17.72,6.4)
  Top Layer w0.2: JMS583.55 25.82,7.1 26.02,6.9 v1(26.02,6.8)
  Bottom Layer w0.172: v1(26.02,6.8) 20.13,6.8 19.93,6.59 18.1,6.59 17.99,6.48 17.8,6.48 v1(17.72,6.4) 17.68,6.4 17.33,6.75 17.33,8.25 17.52,8.44 17.85,8.44 M.2.52
PCIE_RST: length 20
  Top Layer w0.172: v1(17.32,5.7) 17.3,5.7 16.93,6.07 16.93,6.61 17.53,7.22 18.3,7.22 R1.1
  Top Layer w0.2: v1(26.82,6) 26.74,6.08 26.28,6.08 26.12,6.23 25.65,6.23 25.42,6.47 JMS583.54
  Bottom Layer w0.172: v1(26.82,6) 26.74,6.08 26.53,6.08 26.5,6.11 26,6.11 25.6,6.51 20.26,6.51 20.05,6.3 18.62,6.3 18,5.68 17.34,5.68 v1(17.32,5.7) 17.3,5.7 16.93,6.07 16.93,8.35 17.52,8.94 17.85,8.94 M.2.50
RST: length 4.7
  Top Layer w0.2: R2.2 33.29,14.93 C9.2 32.12,14.8 31.72,14.4 JMS583.15
RX1_N: length 27.7
  Top Layer w0.125: JMS583.27 25.46,16.14 25.49,16.25 arc(25.5,16.27) 25.5,16.29 arc(25.49,16.32) 25.48,16.36 24.91,17.25 arc(24.8,17.4) 24.67,17.54 arc(24.29,17.8) 23.84,17.89 arc(23.84,17.89) 23.84,17.89 22.91,17.89 arc(22,17.51) 21.62,16.6 arc(21.4,16.07) 20.87,15.86 13.13,15.86 arc(12.16,15.66) 11.34,15.11 10.45,14.22 arc(10.07,13.97) 9.61,13.88 9.32,13.88 arc(9.14,13.84) 8.99,13.74 8.87,13.62 arc(8.85,13.61) v1(8.82,13.6) ; USB1.B10 2.2,13.75 arc(2.29,13.77) 2.36,13.81 arc(2.43,13.86) 2.51,13.88 3.35,13.88 arc(3.68,13.81) 3.97,13.62 arc(3.99,13.61) v1(4.02,13.6)
  Bottom Layer w0.125: v1(8.82,13.6) arc(8.79,13.61) 8.77,13.62 8.65,13.74 arc(8.5,13.84) 8.31,13.88 8.02,13.88 arc(7.93,13.84) 7.9,13.75 7.9,13.7 arc(7.86,13.61) 7.77,13.58 arc(7.69,13.61) 7.65,13.7 7.65,13.75 arc(7.61,13.84) 7.53,13.88 4.52,13.88 arc(4.34,13.84) 4.19,13.74 4.07,13.62 arc(4.05,13.61) v1(4.02,13.6)
RX1_P: length 27.7
  Top Layer w0.125: USB1.B11 2.2,14.25 arc(2.29,14.23) 2.36,14.19 arc(2.43,14.14) 2.51,14.12 3.35,14.12 arc(3.68,14.19) 3.97,14.38 arc(3.99,14.39) v1(4.02,14.4) ; JMS583.26 25.78,16.14 25.75,16.25 arc(25.74,16.27) 25.74,16.29 arc(25.73,16.39) 25.68,16.49 25.11,17.38 arc(24.99,17.55) 24.84,17.72 arc(24.38,18.03) 23.84,18.14 arc(23.84,18.14) 23.84,18.14 22.91,18.14 arc(21.82,17.69) 21.37,16.6 arc(21.23,16.25) 20.87,16.1 13.13,16.1 arc(12.07,15.89) 11.16,15.28 10.31,14.43 arc(9.97,14.2) 9.56,14.12 9.32,14.12 arc(9.14,14.16) 8.99,14.26 8.87,14.38 arc(8.85,14.39) v1(8.82,14.4)
  Bottom Layer w0.125: v1(4.02,14.4) arc(4.05,14.39) 4.07,14.38 4.19,14.26 arc(4.34,14.16) 4.52,14.12 8.31,14.12 arc(8.5,14.16) 8.65,14.26 8.77,14.38 arc(8.79,14.39) v1(8.82,14.4)
RX2_N: length 28.4
  Top Layer w0.125: JMS583.28 25.02,16.05 arc(25.01,16.1) 24.98,16.14 arc(24.95,16.18) 24.94,16.23 24.94,16.29 arc(24.82,16.88) 24.49,17.37 arc(24.19,17.57) 23.84,17.64 22.92,17.64 arc(22.18,17.34) 21.87,16.6 arc(21.58,15.89) 20.87,15.6 13.58,15.6 arc(12.52,15.39) 11.61,14.78 6.57,9.74 arc(6.53,9.71) 6.48,9.7 arc(6.43,9.71) 6.39,9.74 6.32,9.82 arc(6.23,9.88) v1(6.12,9.9)
  Bottom Layer w0.125: USB1.A10 2.2,10.25 arc(2.29,10.23) 2.36,10.19 arc(2.43,10.14) 2.51,10.12 3.35,10.12 arc(3.68,10.06) 3.96,9.87 arc(4.24,9.69) 4.56,9.62 5.45,9.62 arc(5.78,9.69) 6.07,9.88 arc(6.09,9.89) v1(6.12,9.9)
RX2_P: length 28.5
  Top Layer w0.125: JMS583.29 24.62,16.05 arc(24.63,16.1) 24.66,16.14 arc(24.69,16.18) 24.7,16.23 24.7,16.29 arc(24.6,16.78) 24.32,17.2 arc(24.1,17.35) 23.84,17.4 22.92,17.4 arc(22.35,17.17) 22.12,16.6 arc(21.75,15.72) 20.87,15.36 14.38,15.36 arc(14.3,15.32) 14.26,15.23 14.26,15.18 arc(14.22,15.09) 14.14,15.06 arc(14.05,15.09) 14.02,15.18 14.02,15.23 arc(13.98,15.32) 13.89,15.36 13.58,15.36 arc(12.61,15.16) 11.79,14.61 6.94,9.77 arc(6.94,9.77) 6.94,9.77 6.69,9.51 arc(6.63,9.47) 6.56,9.46 arc(6.48,9.45) 6.42,9.4 v1(6.12,9.1)
  Bottom Layer w0.125: USB1.A11 2.2,9.75 arc(2.29,9.77) 2.36,9.81 arc(2.43,9.86) 2.51,9.88 3.1,9.88 arc(3.57,9.78) 3.96,9.52 arc(4.12,9.41) 4.31,9.38 5.45,9.38 arc(5.78,9.31) 6.07,9.12 arc(6.09,9.11) v1(6.12,9.1)
TX1_N: length 11.5
  Top Layer w0.125: JMS583.22 27.42,16.05 arc(27.43,16.1) 27.46,16.14 arc(27.49,16.18) 27.5,16.23 27.5,16.96 arc(26.75,18.76) 24.96,19.5 20.74,19.5 arc(20.65,19.46) 20.62,19.38 20.62,19.32 arc(20.58,19.24) 20.49,19.2 arc(20.41,19.24) 20.37,19.32 20.37,19.38 arc(20.33,19.46) 20.25,19.5 19.99,19.5 arc(19.98,19.5) 19.97,19.49 arc(19.95,19.48) 19.94,19.48 19.72,19.48 arc(19.67,19.47) 19.63,19.44 arc(19.61,19.4) 19.6,19.35 arc(19.57,19.22) 19.49,19.11 19.48,19.09 arc(19.38,19.02) C6.2
TX1_P: length 11.5
  Top Layer w0.125: JMS583.21 27.82,16.05 arc(27.81,16.1) 27.78,16.14 arc(27.75,16.18) 27.74,16.23 27.74,16.96 arc(26.93,18.93) 24.96,19.75 19.89,19.75 arc(19.88,19.74) 19.86,19.73 arc(19.85,19.73) 19.84,19.72 19.72,19.72 arc(19.67,19.73) 19.63,19.76 arc(19.61,19.8) 19.6,19.85 arc(19.57,19.98) 19.49,20.09 19.48,20.11 arc(19.38,20.18) C7.2
TX2_N: length 10.3
  Top Layer w0.125: JMS583.23 27.02,16.05 arc(27.01,16.1) 26.98,16.14 arc(26.95,16.18) 26.94,16.23 26.94,16.6 arc(26.34,18.05) 24.9,18.64 22.57,18.64 arc(21.7,18.47) 20.97,17.98 20.58,17.6 arc(20.28,17.4) 19.93,17.33 arc(19.75,17.36) 19.6,17.46 C11.2
TX2_P: length 10
  Top Layer w0.125: JMS583.24 26.62,16.05 arc(26.63,16.1) 26.66,16.14 arc(26.69,16.18) 26.7,16.23 26.7,16.6 arc(26.17,17.87) 24.9,18.4 22.67,18.4 arc(21.81,18.23) 21.07,17.74 20.72,17.39 arc(20.38,17.16) 19.98,17.08 19.6,17.08 arc(19.43,17.01) 19.36,16.84 19.36,16.81 19.26,16.62
U_TX1_N: length 21.2
  Top Layer w0.125: v1(6.18,14.93) 6.21,14.96 6.21,15.35 6.52,15.66 6.52,17.7 arc(7.04,18.96) 8.3,19.48 17.72,19.48 arc(17.76,19.47) 17.8,19.44 arc(17.83,19.4) 17.84,19.35 17.84,19.31 arc(17.86,19.22) 17.91,19.14 17.96,19.09 arc(18.06,19.02) C6.1
  Bottom Layer w0.125: USB1.A3 2.2,13.75 arc(2.29,13.77) 2.36,13.81 arc(2.43,13.86) 2.51,13.88 2.54,13.88 arc(2.56,13.87) 2.57,13.87 arc(2.58,13.86) 2.6,13.86 2.92,13.86 arc(3.27,14) 3.42,14.36 3.42,14.6 arc(3.51,14.83) 3.75,14.93 4.79,14.93 arc(4.89,14.91) 4.98,14.85 arc(5.07,14.79) 5.17,14.77 5.52,14.77 arc(5.62,14.79) 5.7,14.84 arc(5.78,14.89) 5.87,14.91 6.13,14.91 arc(6.16,14.92) v1(6.18,14.93)
U_TX1_P: length 21.2
  Top Layer w0.125: v1(5.62,15.5) 5.64,15.52 6.03,15.52 6.27,15.76 6.27,17.7 arc(6.87,19.13) 8.3,19.72 17.72,19.72 arc(17.76,19.73) 17.8,19.76 arc(17.83,19.8) 17.84,19.85 17.84,19.89 arc(17.86,19.98) 17.91,20.06 17.96,20.11 arc(18.06,20.18) C7.1
  Bottom Layer w0.125: USB1.A2 2.2,14.25 arc(2.29,14.23) 2.36,14.19 arc(2.43,14.14) 2.51,14.12 2.64,14.12 arc(2.66,14.12) 2.67,14.11 arc(2.68,14.1) 2.7,14.1 2.92,14.1 arc(3.1,14.17) 3.17,14.36 3.17,14.7 arc(3.31,15.03) 3.64,15.17 4.89,15.17 arc(4.99,15.15) 5.08,15.09 arc(5.17,15.03) 5.27,15.01 5.47,15.01 arc(5.52,15.02) 5.56,15.05 arc(5.59,15.09) 5.6,15.14 5.6,15.45 arc(5.6,15.48) v1(5.62,15.5)
U_TX2_N: length 21.6
  Top Layer w0.125: USB1.B3 2.2,10.25 arc(2.29,10.23) 2.36,10.19 arc(2.43,10.14) 2.51,10.12 4.21,10.12 arc(4.7,10.22) 5.12,10.5 6.43,11.81 arc(6.98,12.64) 7.17,13.61 7.17,15.35 arc(7.75,16.74) 9.15,17.32 17.72,17.32 arc(17.76,17.33) 17.8,17.36 arc(17.83,17.4) 17.84,17.45 17.84,17.49 arc(17.86,17.58) 17.91,17.66 17.96,17.71 arc(18.06,17.78) C11.1
U_TX2_P: length 21.5
  Top Layer w0.125: USB1.B2 2.2,9.75 arc(2.29,9.77) 2.36,9.81 arc(2.43,9.86) 2.51,9.88 4.21,9.88 arc(4.79,9.99) 5.29,10.33 6.6,11.64 arc(7.21,12.54) 7.42,13.61 7.42,15.25 arc(7.96,16.54) 9.25,17.08 17.72,17.08 arc(17.76,17.07) 17.8,17.04 arc(17.83,17) 17.84,16.95 17.84,16.91 arc(17.86,16.82) 17.91,16.74 17.96,16.69 arc(18.06,16.62) C10.1
XIN: length 8.9
  Top Layer w0.172: JMS583.50 23.8,7.79 23.8,7.35 22.15,5.7 21.73,5.7 21.38,5.35 21.38,4.11 20.22,2.95 X1.1 20.02,2.95 19.21,3.75 C8.2
XOUT: length 5.6
  Top Layer w0.172: C2.2 23.92,4.83 23.73,4.65 X1.3 22.33,4.66 22.33,5.41 24.21,7.29 24.21,7.79 JMS583.51

## Copper pours and planes (outline as drawn; the poured copper is in the pictures)
3V3 on Top Layer: 34.12,4.9 44.72,4.9 44.72,0.7 34.12,0.7
AVDDL on Top Layer: 37.62,17.7 44.72,17.7 44.72,13.9 37.62,13.9
AVDDL on Top Layer: 28.32,4.1 33.02,4.1 33.02,2.3 28.32,2.3
GND on Top Layer: 40.22,20.7 44.72,20.7 44.72,17.9 40.22,17.9
GND on Top Layer: 40.22,8 44.72,8 44.72,5.2 40.22,5.2
GND on Top Layer: 0.92,9.25 2.52,9.25 2.52,6.2 0.92,6.2
GND on Top Layer: 3.22,0 1.45,0.73 0.72,2.5 0.72,21.5 1.45,23.27 3.22,24 98.22,24 99.98,23.27 100.72,21.5 100.72,2.5 99.98,0.73 98.22,0
GND on Top Layer: 0.92,17.9 2.52,17.9 2.52,14.75 0.92,14.75
GND on Bottom Layer: 0.92,9.25 2.52,9.25 2.52,6.2 0.92,6.2
GND on Bottom Layer: 0.92,17.9 2.52,17.9 2.52,14.75 0.92,14.75
GND on Bottom Layer: 3.22,0 1.45,0.73 0.72,2.5 0.72,21.5 1.45,23.27 3.22,24 98.22,24 99.98,23.27 100.72,21.5 100.72,2.5 99.98,0.73 98.22,0
GND on GND: 3.22,0 1.45,0.73 0.72,2.5 0.72,21.5 1.45,23.27 3.22,24 98.22,24 99.98,23.27 100.72,21.5 100.72,2.5 99.98,0.73 98.22,0
GND on VCC: 3.22,0 1.45,0.73 0.72,2.5 0.72,21.5 1.45,23.27 3.22,24 98.22,24 99.98,23.27 100.72,21.5 100.72,2.5 99.98,0.73 98.22,0
VCC on Top Layer: 28.47,18.21 29.32,18.21 29.32,15.4 28.47,15.4
VDDREG on Top Layer: 30.02,16.1 31.32,16.1 31.32,14.7 30.02,14.7
VDDREG on Top Layer: 30.02,8.9 33.82,8.9 33.82,6 30.02,6
VDDREG on Top Layer: 40.32,23 44.72,23 44.72,20.6 40.32,20.6
VDDREG on Top Layer: 40.32,10.3 44.72,10.3 44.72,7.9 40.32,7.9
LXO on Top Layer: 28.42,8.2 30.32,8.2 30.32,4.4 28.42,4.4
M.2_3V3 on Top Layer: 29.82,2.1 33.32,2.1 33.32,0.7 29.82,0.7
M.2_3V3 on Bottom Layer: 17.52,22.1 21.12,22.1 21.12,20.3 17.52,20.3
M.2_3V3 on Bottom Layer: 17.52,4.16 21.22,4.16 21.22,0.3 17.52,0.3
M.2_3V3 on Bottom Layer: 16.02,18.9 18.32,18.9 18.32,16.8 16.02,16.8
M.2_3V3 on VCC: 15.72,22.1 21.12,22.1 21.12,17.1 15.72,17.1
M.2_3V3 on VCC: 15.12,19.1 21.32,19.1 21.32,0.3 15.12,0.3
M.2_3V3 on VCC: 17.52,2.2 32.22,2.2 32.22,0.3 17.52,0.3
NETL3_2 on Top Layer: 39.82,19.8 42.02,19.8 42.02,17.1 39.82,17.1
NETL4_2 on Top Layer: 39.82,7.1 42.02,7.1 42.02,4.5 39.82,4.5

Small or netless copper shapes (teardrops, artwork), in the pictures only: 136 on Top Layer, 79 on Bottom Layer, 7 on VCC

## Text on the board
Bottom Silkscreen Layer: Designed_By_Ideal_Fox
Mechanical Layer: 13,5 | 45 | 50 | 30 | 57 | 62 | 42 | 100 | 95 | 80 | R2,5 | ?4 | 19 | 24 | ?2,05
